# Altium schematic sheet Gates.SchDoc
size 431 x 279 mm; SheetNumber: 8; SheetTotal: 9
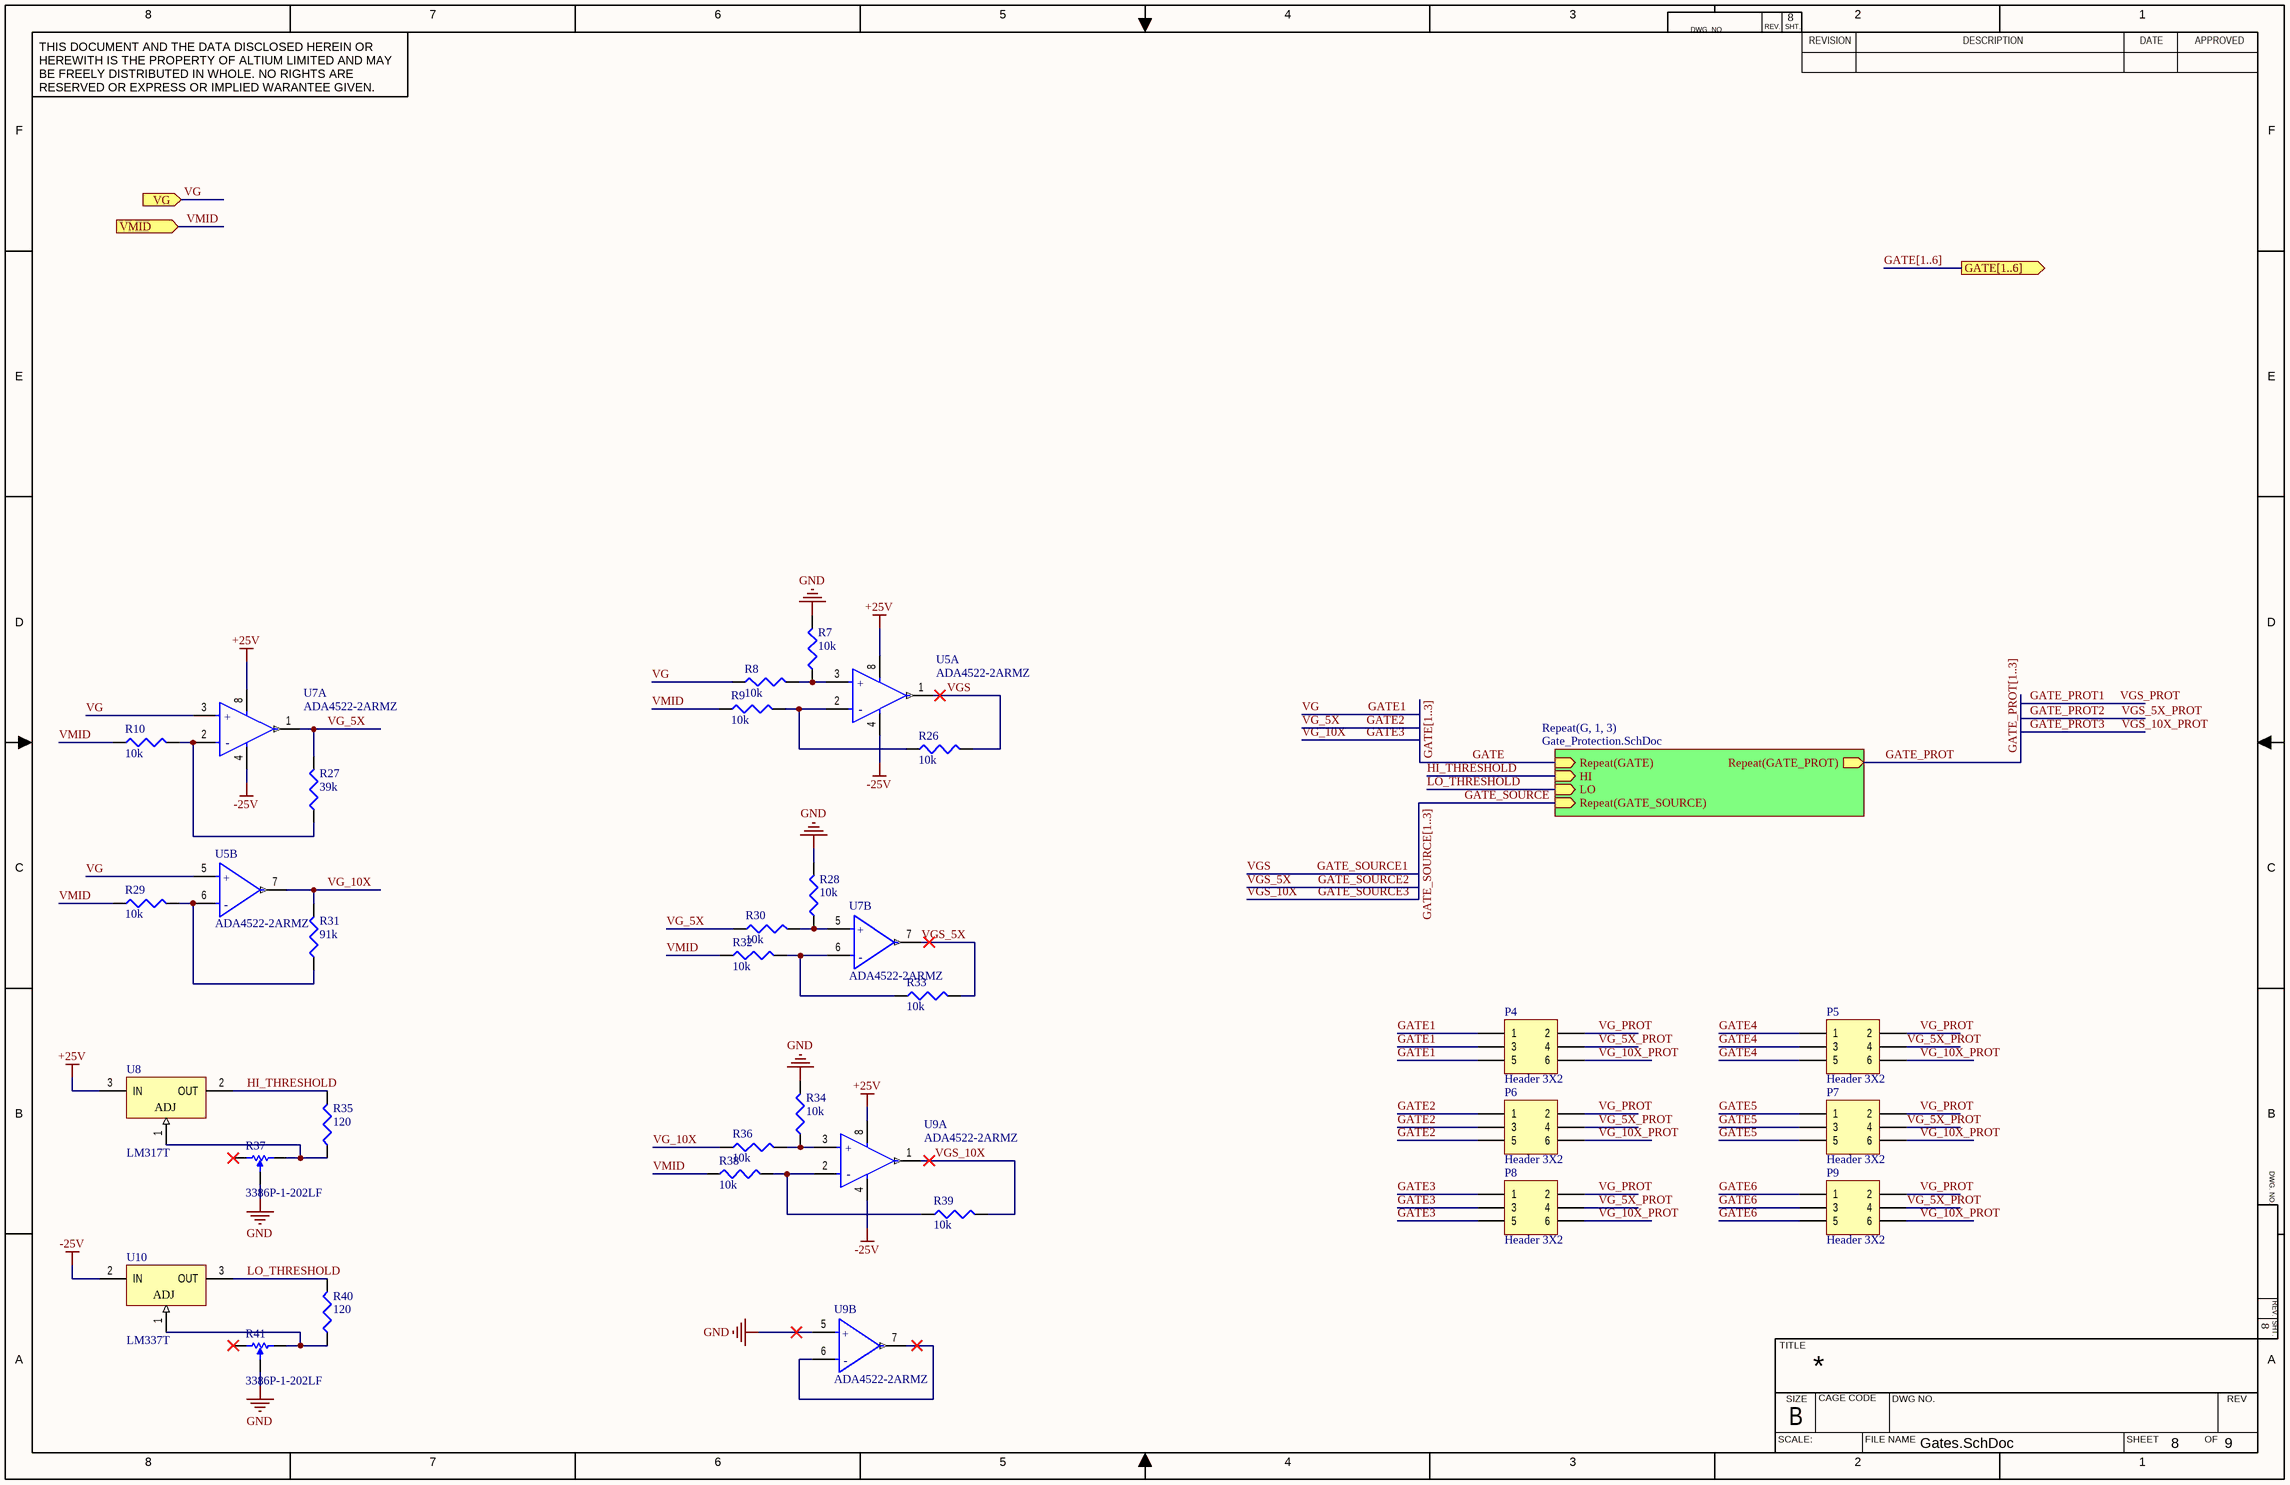
[diagram p0: Gates.SchDoc]

## Parts
P4  Header 3X2  [HDR2X3]
P5  Header 3X2  [HDR2X3]
P6  Header 3X2  [HDR2X3]
P7  Header 3X2  [HDR2X3]
P8  Header 3X2  [HDR2X3]
P9  Header 3X2  [HDR2X3]
R7  10k  [J1-0603]
R8  10k  [J1-0603]
R9  10k  [J1-0603]
R10  10k  [J1-0603]
R26  10k  [J1-0603]
R27  39k  [J1-0603]
R28  10k  [J1-0603]
R29  10k  [J1-0603]
R30  10k  [J1-0603]
R31  91k  [J1-0603]
R32  10k  [J1-0603]
R33  10k  [J1-0603]
R34  10k  [J1-0603]
R35  120  [J1-0603]
R36  10k  [J1-0603]
R37  3386P-1-202LF  [BOUR-3386P]
R38  10k  [J1-0603]
R39  10k  [J1-0603]
R40  120  [J1-0603]
R41  3386P-1-202LF  [BOUR-3386P]
U5  ADA4522-2ARMZ  [FP-RM-8-IPC_C]  (parts A,B of 2)
U7  ADA4522-2ARMZ  [FP-RM-8-IPC_C]  (parts A,B of 2)
U8  LM317T  [TO-220]
U9  ADA4522-2ARMZ  [FP-RM-8-IPC_C]  (parts A,B of 2)
U10  LM337T  [NDE0003A]

## Sub-sheets
Repeat(G, 1, 3) = Gate_Protection.SchDoc: Repeat(GATE) (in), HI (in), LO (in), Repeat(GATE_PROT) (out), Repeat(GATE_SOURCE) (in)

## Ports
GATE[1..6] (out), VG (in), VMID (in)

## Nets
+25V: U5.8(V+) U7.8(V+) U8.3(IN) U9.8(V+)
-25V: U5.4(V-) U7.4(V-) U9.4(V-) U10.2(IN)
GND: R7.2 R28.2 R34.2 R37.2 R41.2 U9.5(+IN_B)
GATE: sheet Repeat(G, 1, 3)/Repeat(GATE)
GATE1: P4.1 P4.3 P4.5 R8.1 U5.5(+IN_B) U7.3(+IN_A) ; port VG  [also labelled VG]
GATE2: P6.1 P6.3 P6.5 R27.2 R30.1 U7.1(OUT_A)  [also labelled VG_5X]
GATE3: P8.1 P8.3 P8.5 R31.2 R36.1 U5.7(OUT_B)  [also labelled VG_10X]
GATE4: P5.1 P5.3 P5.5
GATE5: P7.1 P7.3 P7.5
GATE6: P9.1 P9.3 P9.5
GATE_PROT: sheet Repeat(G, 1, 3)/Repeat(GATE_PROT)
GATE_SOURCE: sheet Repeat(G, 1, 3)/Repeat(GATE_SOURCE)
GATE_SOURCE1: R26.2 U5.1(OUT_A)  [also labelled VGS]
GATE_SOURCE2: R33.2 U7.7(OUT_B)  [also labelled VGS_5X]
GATE_SOURCE3: R39.2 U9.1(OUT_A)  [also labelled VGS_10X]
HI_THRESHOLD: R35.2 U8.2(OUT) ; sheet Repeat(G, 1, 3)/HI
LO_THRESHOLD: R40.2 U10.3(OUT) ; sheet Repeat(G, 1, 3)/LO
VG_5X_PROT: P4.4 P5.4 P6.4 P7.4 P8.4 P9.4
VG_10X_PROT: P4.6 P5.6 P6.6 P7.6 P8.6 P9.6
VG_PROT: P4.2 P5.2 P6.2 P7.2 P8.2 P9.2
VMID: R9.1 R10.1 R29.1 R32.1 R38.1 ; port VMID
NetR7_1: R7.1 R8.2 U5.3(+IN_A)
NetR9_2: R9.2 R26.1 U5.2(-IN_A)
NetR10_2: R10.2 R27.1 U7.2(-IN_A)
NetR28_1: R28.1 R30.2 U7.5(+IN_B)
NetR29_2: R29.2 R31.1 U5.6(-IN_B)
NetR32_2: R32.2 R33.1 U7.6(-IN_B)
NetR34_1: R34.1 R36.2 U9.3(+IN_A)
NetR35_1: R35.1 R37.3 U8.1(ADJ)
NetR38_2: R38.2 R39.1 U9.2(-IN_A)
NetR40_1: R40.1 R41.3 U10.1(ADJ)
NetU9_6: U9.6(-IN_B) U9.7(OUT_B)

Not connected (* = marked no-connect by the designer): R37 1*; R41 1*

## Buses and harness runs
bus GATE[1..3]
bus GATE[1..6] = port GATE[1..6]
bus GATE_PROT[1..3]
bus GATE_SOURCE[1..3]

## Notes on the sheet
- 8
- 7
- 6
- 5
- 4
- 3
- DWG. NO.
- REV.
- SHT.
- 2
- 1
- THIS DOCUMENT AND THE DATA DISCLOSED HEREIN OR HEREWITH IS THE PROPERTY OF ALTIUM LIMITED AND MAY BE FREELY DISTRIBUTED IN WHOLE. NO RIGHTS ARE RESERVED OR EXPRESS OR IMPLIED WARANTEE GIVEN.
- REVISION
- DESCRIPTION
- DATE
- APPROVED
- F
- E
- D
- C
- B
- A
- TITLE
- SCALE:
- SIZE
- CAGE CODE
- FILE NAME
- DWG NO.
- SHEET
- OF
- REV
- (in symbol CMP-09116-000003-2, part A) +; -
- (in symbol CMP-09116-000003-2, part B) +; -

## Library data of the parts
P4-P9 = Header 3X2: Header, 3-Pin, Dual row; LatestRevisionDate: 17-Jul-2002; LatestRevisionNote: Re-released for DXP Platform.; Publisher: Altium Limited
R7-R10 R26-R36 R38-R40 = Res3: Resistor; Published: 8-Jun-2000; LatestRevisionDate: 29-May-2009; LatestRevisionNote: IPC-7351 Footprint Added.; PackageReference: J1-0603; Publisher: Altium Limited; PackageDescription: Chip Resistor
R37 R41 = CMP-2000-05592-1: Square Trimpot(R) Trimming Potentiometer, 2 KOhm, +/- 10%, 0.5 W, -55 to 125 degC, 3-Pin THD, RoHS, Tube; Manufacturer Series: 3386; Manufacturer: Bourns; Resistive Element Material: Cermet; Shaft Diameter: 3.15mm; Number of Turns: 1; Product Height: 4.83mm; Temperature Coefficient: 100ppm/C; Product Depth: 9.53mm; Rated Temperature (Cel): 85; Actuator Orientation: Vertical; Resistance (ohm): 100000; Power Rating: 1/2W; Tolerance (%): 10; Rated Power Dissipation (P) (W): 0.5; Resistance Law: Linear; Resistance Value: 100KOhm; Actuator Type: Screw; Operating Temperature-Min (Cel): -55; Manufacturer URL: http://www.bourns.com/; Terminal Finish: TINLEAD; Datasheet Version: 05/2016; Tolerance: 10%; Lead Free: NO; Family: 3386; Product Length: 9.53mm; Mounting: ThroughHole; Packaging: Tube; Package: RectangularPackage; Mounting Feature: ThroughHole; Number of Terminals: 3; Minimum Operating Temperature: -55C; Mounting Technology: ThroughHole; Package Reference: 3386P; Maximum Operating Temperature: 125C; Termination Style: Pin; Datasheet URL: http://www.bourns.com/docs/Product-Datasheets/3386.pdf; Package Description: 3-Pin Through Hole Device, Body 9.53 x 9.53 mm, Pitch 2.54 mm; Product Type: Potentiometer; Operating Temperature-Max (Cel): 125; Terminal Shape: WIRE; Technology: Cermet; Type: Trimmer
U5 U7 U9 = CMP-09116-000003-2: IC OPAMP ZERO-DRIFT 2 CIRC 8MSOP; Max Dual Supply Voltage: 27.5V; Power Supply Rejection Ratio (PSRR): 150dB; Operating Supply Current: 830uA; Max Supply Voltage: 55V; Min Dual Supply Voltage: 2.25V; Input Bias Current: 50pA; Gain Bandwidth Product: 2.7MHz; Voltage Gain: 137dB; Common Mode Rejection Ratio: 140dB; Slew Rate: 1.7V/µs; Input Offset Voltage (Vos): 1.5uV; Output Current per Channel: 32mA; Min Supply Voltage: 4.5V; Packaging: Rail/Tube; Max Operating Temperature: 125°C; Min Operating Temperature: -40°C; Mount: Surface Mount; Number of Pins: 8; Case/Package: MSOP; Lead Free: Contains Lead
U8 = CMP-0244-00444-1: 1.5A, 1.2V to 37V Adjustable Voltage Regulator, 3-Pin TO-220; PackageVersion: 2011; ComponentLink1URL: http://www.st.com; ComponentLink2URL: http://www.st.com/internet/com/TECHNICAL_RESOURCES/TECHNICAL_LITERATURE/DATASHEET/CD00000455.pdf; PackageDescription: TO, Thru-Hole, Vertical, Heatsink Mounted; 3 In-Line Leads; Pitch 2.54 mm; PackageReference: TO-220; ComponentLink1Description: Manufacturer URL; ComponentLink3URL: http://www.st.com/internet/com/TECHNICAL_RESOURCES/TECHNICAL_LITERATURE/PACKAGE_INFORMATION/CD00004649.pdf; DatasheetVersion: 1/11/2011; ComponentLink2Description: Datasheet; ComponentLink3Description: Package Specification
U10 = CMP-0062-02470-3: 3-Terminal Adjustable Negative Regulator, 3-pin TO-220; Manufacturer: Texas Instruments; CompType: LDO IC; PackageTopMarking: NSUZXYTTE#*LM337T P+; PowerWise: N; RoHS: N; ComponentLink1Description: Datasheet URL; ComponentLink1URL: http://www.ti.com/general/docs/lit/getliterature.tsp?genericPartNumber=LM337-N&fileType=pdf; PinCount: 3; PackageReference: NDE0003A; PackageDescription: TO-220, Molded, 3 Lead, Straight